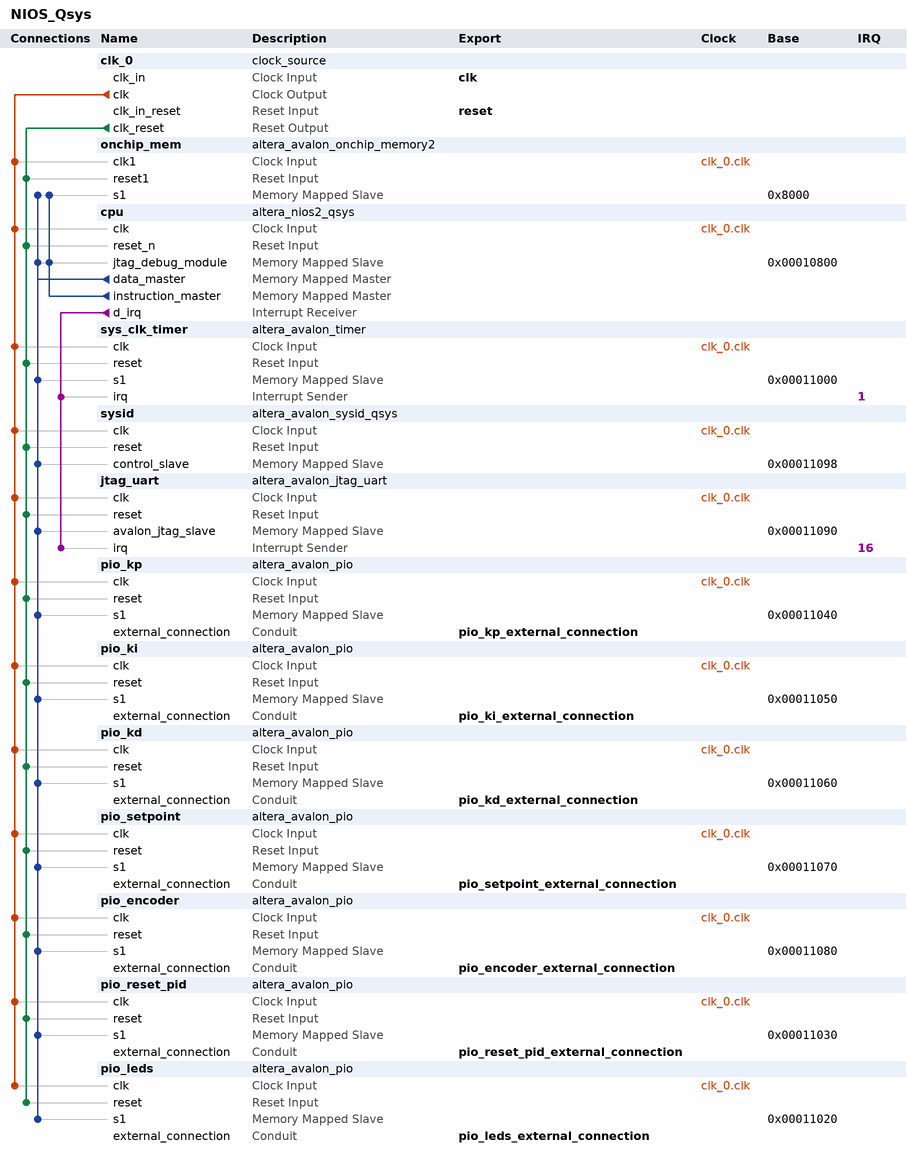
[diagram p0: system contents]
# Platform Designer (Qsys) system NIOS_Qsys, Cyclone III EP3C16F484C6
# Parameters at their usual value, and those the tool derives, are not listed.
package require -exact qsys 13.1
create_system NIOS_Qsys
set_project_property DEVICE_FAMILY {Cyclone III}
set_project_property DEVICE EP3C16F484C6

add_instance clk_0 clock_source 13.1
set_instance_parameter_value clk_0 clockFrequency 50000000

add_instance onchip_mem altera_avalon_onchip_memory2 13.1
set_instance_parameter_value onchip_mem dataWidth 32
set_instance_parameter_value onchip_mem dualPort false
set_instance_parameter_value onchip_mem initMemContent true
set_instance_parameter_value onchip_mem initializationFileName onchip_mem.hex
set_instance_parameter_value onchip_mem memorySize 25000

add_instance cpu altera_nios2_qsys 13.1
set_instance_parameter_value cpu resetSlave onchip_mem.s1
set_instance_parameter_value cpu mmu_TLBMissExcSlave None
set_instance_parameter_value cpu exceptionSlave onchip_mem.s1
set_instance_parameter_value cpu breakSlave cpu.jtag_debug_module
set_instance_parameter_value cpu muldiv_multiplierType NoneSmall
set_instance_parameter_value cpu impl Small
set_instance_parameter_value cpu icache_size 2048

add_instance sys_clk_timer altera_avalon_timer 13.1
set_instance_parameter_value sys_clk_timer period 1
set_instance_parameter_value sys_clk_timer periodUnits MSEC

add_instance sysid altera_avalon_sysid_qsys 13.1
set_instance_parameter_value sysid id 0

add_instance jtag_uart altera_avalon_jtag_uart 13.1
set_instance_parameter_value jtag_uart simInteractiveOptions NO_INTERACTIVE_WINDOWS

add_instance pio_kp altera_avalon_pio 13.1
set_instance_parameter_value pio_kp direction Output
set_instance_parameter_value pio_kp width 10

add_instance pio_ki altera_avalon_pio 13.1
set_instance_parameter_value pio_ki direction Output
set_instance_parameter_value pio_ki width 10

add_instance pio_kd altera_avalon_pio 13.1
set_instance_parameter_value pio_kd direction Output
set_instance_parameter_value pio_kd width 10

add_instance pio_setpoint altera_avalon_pio 13.1
set_instance_parameter_value pio_setpoint direction Output
set_instance_parameter_value pio_setpoint width 10

add_instance pio_encoder altera_avalon_pio 13.1
set_instance_parameter_value pio_encoder direction Input
set_instance_parameter_value pio_encoder width 16

add_instance pio_reset_pid altera_avalon_pio 13.1
set_instance_parameter_value pio_reset_pid direction Output
set_instance_parameter_value pio_reset_pid width 1

add_instance pio_leds altera_avalon_pio 13.1
set_instance_parameter_value pio_leds direction Output
set_instance_parameter_value pio_leds width 10

# connections
add_connection clk_0.clk cpu.clk clock
add_connection clk_0.clk jtag_uart.clk clock
add_connection clk_0.clk onchip_mem.clk1 clock
add_connection clk_0.clk pio_encoder.clk clock
add_connection clk_0.clk pio_kd.clk clock
add_connection clk_0.clk pio_ki.clk clock
add_connection clk_0.clk pio_kp.clk clock
add_connection clk_0.clk pio_leds.clk clock
add_connection clk_0.clk pio_reset_pid.clk clock
add_connection clk_0.clk pio_setpoint.clk clock
add_connection clk_0.clk sys_clk_timer.clk clock
add_connection clk_0.clk sysid.clk clock
add_connection clk_0.clk_reset cpu.reset_n reset
add_connection clk_0.clk_reset jtag_uart.reset reset
add_connection clk_0.clk_reset onchip_mem.reset1 reset
add_connection clk_0.clk_reset pio_encoder.reset reset
add_connection clk_0.clk_reset pio_kd.reset reset
add_connection clk_0.clk_reset pio_ki.reset reset
add_connection clk_0.clk_reset pio_kp.reset reset
add_connection clk_0.clk_reset pio_leds.reset reset
add_connection clk_0.clk_reset pio_reset_pid.reset reset
add_connection clk_0.clk_reset pio_setpoint.reset reset
add_connection clk_0.clk_reset sys_clk_timer.reset reset
add_connection clk_0.clk_reset sysid.reset reset
add_connection cpu.data_master cpu.jtag_debug_module avalon
set_connection_parameter_value cpu.data_master/cpu.jtag_debug_module baseAddress 0x00010800
add_connection cpu.data_master jtag_uart.avalon_jtag_slave avalon
set_connection_parameter_value cpu.data_master/jtag_uart.avalon_jtag_slave baseAddress 0x00011090
add_connection cpu.data_master onchip_mem.s1 avalon
set_connection_parameter_value cpu.data_master/onchip_mem.s1 baseAddress 0x8000
add_connection cpu.data_master pio_encoder.s1 avalon
set_connection_parameter_value cpu.data_master/pio_encoder.s1 baseAddress 0x00011080
add_connection cpu.data_master pio_kd.s1 avalon
set_connection_parameter_value cpu.data_master/pio_kd.s1 baseAddress 0x00011060
add_connection cpu.data_master pio_ki.s1 avalon
set_connection_parameter_value cpu.data_master/pio_ki.s1 baseAddress 0x00011050
add_connection cpu.data_master pio_kp.s1 avalon
set_connection_parameter_value cpu.data_master/pio_kp.s1 baseAddress 0x00011040
add_connection cpu.data_master pio_leds.s1 avalon
set_connection_parameter_value cpu.data_master/pio_leds.s1 baseAddress 0x00011020
add_connection cpu.data_master pio_reset_pid.s1 avalon
set_connection_parameter_value cpu.data_master/pio_reset_pid.s1 baseAddress 0x00011030
add_connection cpu.data_master pio_setpoint.s1 avalon
set_connection_parameter_value cpu.data_master/pio_setpoint.s1 baseAddress 0x00011070
add_connection cpu.data_master sys_clk_timer.s1 avalon
set_connection_parameter_value cpu.data_master/sys_clk_timer.s1 baseAddress 0x00011000
add_connection cpu.data_master sysid.control_slave avalon
set_connection_parameter_value cpu.data_master/sysid.control_slave baseAddress 0x00011098
add_connection cpu.instruction_master cpu.jtag_debug_module avalon
set_connection_parameter_value cpu.instruction_master/cpu.jtag_debug_module baseAddress 0x00010800
add_connection cpu.instruction_master onchip_mem.s1 avalon
set_connection_parameter_value cpu.instruction_master/onchip_mem.s1 baseAddress 0x8000
add_connection cpu.d_irq jtag_uart.irq interrupt
set_connection_parameter_value cpu.d_irq/jtag_uart.irq irqNumber 16
add_connection cpu.d_irq sys_clk_timer.irq interrupt
set_connection_parameter_value cpu.d_irq/sys_clk_timer.irq irqNumber 1

# exported interfaces
add_interface clk clock sink
set_interface_property clk EXPORT_OF clk_0.clk_in
add_interface reset reset sink
set_interface_property reset EXPORT_OF clk_0.clk_in_reset
add_interface pio_kp_external_connection conduit end
set_interface_property pio_kp_external_connection EXPORT_OF pio_kp.external_connection
add_interface pio_ki_external_connection conduit end
set_interface_property pio_ki_external_connection EXPORT_OF pio_ki.external_connection
add_interface pio_kd_external_connection conduit end
set_interface_property pio_kd_external_connection EXPORT_OF pio_kd.external_connection
add_interface pio_setpoint_external_connection conduit end
set_interface_property pio_setpoint_external_connection EXPORT_OF pio_setpoint.external_connection
add_interface pio_encoder_external_connection conduit end
set_interface_property pio_encoder_external_connection EXPORT_OF pio_encoder.external_connection
add_interface pio_reset_pid_external_connection conduit end
set_interface_property pio_reset_pid_external_connection EXPORT_OF pio_reset_pid.external_connection
add_interface pio_leds_external_connection conduit end
set_interface_property pio_leds_external_connection EXPORT_OF pio_leds.external_connection

set_interconnect_requirement {$system} qsys_mm.clockCrossingAdapter HANDSHAKE
set_interconnect_requirement {$system} qsys_mm.maxAdditionalLatency 1
set_interconnect_requirement {$system} qsys_mm.insertDefaultSlave false

save_system NIOS_Qsys.qsys
